# Altium project control_block.PrjPcb
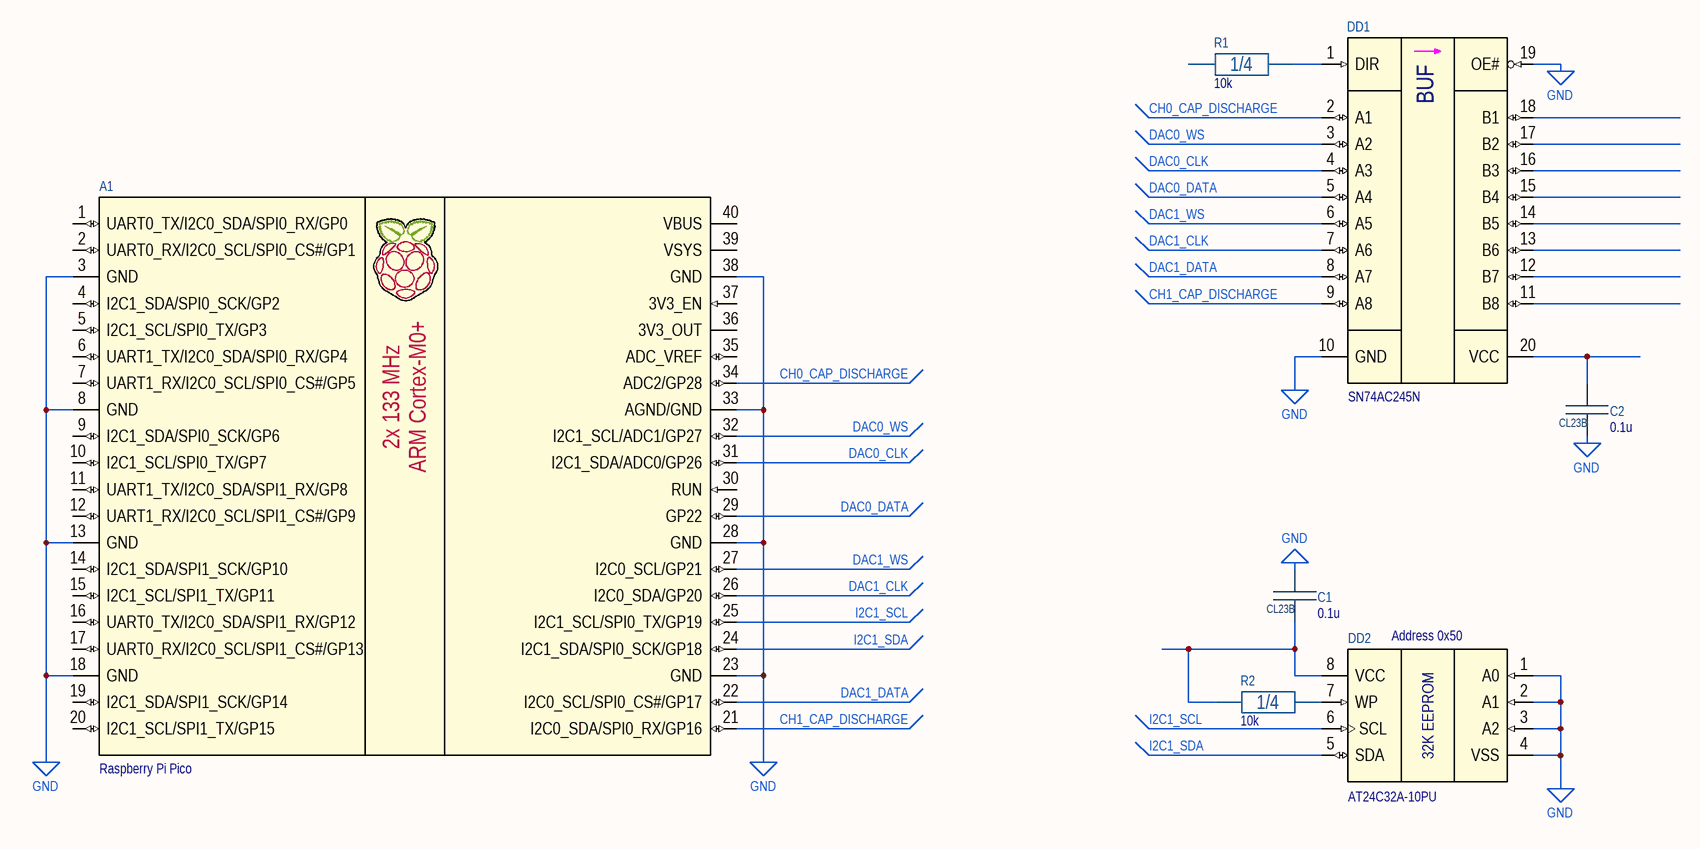
[diagram p0: p1_control_block.SchDoc]
4 sheets, 147 parts. Net scope: global (net labels, ports and power ports of the same name join across sheets).
Sheets:
  p1_control_block.SchDoc
  p2_eth_rs232.SchDoc
  p3_keypad_encoder_led.SchDoc
  p4_power_measure_ch1.SchDoc

## Sheet p1_control_block.SchDoc
size A2; Organization: Protel International P/L; Address1: L3, 12a Rodborough Rd; Address2: Frenchs Forest; Address3: NSW; Address4: Australia 2086

### Parts
A1  Raspberry Pi Pico  [Raspberry_Pi_Pico]
C1  0.1u  [CL23B_7.2x2.5]
C2  0.1u  [CL23B_7.2x2.5]
DD1  SN74AC245N  [DIP-20P-M01]
DD2  AT24C32A-10PU  [DIP-8P-M01_with_SO8]
R1  10k  Package: 1/4  [CFR-25]
R2  10k  Package: 1/4  [CFR-25]

### Nets
GND: A1.3(GND) A1.8(GND) A1.13(GND) A1.18(GND) A1.23(GND) A1.28(GND) A1.33(AGND/GND) A1.38(GND) C1.1 C2.2 DD1.10(GND) DD1.19(OE#) DD2.1(A0) DD2.2(A1) DD2.3(A2) DD2.4(VSS)
CH0_CAP_DISCHARGE: A1.34(ADC2/GP28) DD1.2(A1)
CH1_CAP_DISCHARGE: A1.21(I2C0_SDA/SPI0_RX/GP16) DD1.9(A8)
DAC0_CLK: A1.31(I2C1_SDA/ADC0/GP26) DD1.4(A3)
DAC0_DATA: A1.29(GP22) DD1.5(A4)
DAC0_WS: A1.32(I2C1_SCL/ADC1/GP27) DD1.3(A2)
DAC1_CLK: A1.26(I2C0_SDA/GP20) DD1.7(A6)
DAC1_DATA: A1.22(I2C0_SCL/SPI0_CS#/GP17) DD1.8(A7)
DAC1_WS: A1.27(I2C0_SCL/GP21) DD1.6(A5)
I2C1_SCL: A1.25(I2C1_SCL/SPI0_TX/GP19) DD2.6(SCL)
I2C1_SDA: A1.24(I2C1_SDA/SPI0_SCK/GP18) DD2.5(SDA)
NetC1_2: C1.2 DD2.8(VCC) R2.1
NetC2_1: C2.1 DD1.20(VCC)
NetDD1_1: DD1.1(DIR) R1.2
NetDD2_7: DD2.7(WP) R2.2

Not connected (* = marked no-connect by the designer): A1 1(UART0_TX/I2C0_SDA/SPI0_RX/GP0) 2(UART0_RX/I2C0_SCL/SPI0_CS#/GP1) 4(I2C1_SDA/SPI0_SCK/GP2) 5(I2C1_SCL/SPI0_TX/GP3) 6(UART1_TX/I2C0_SDA/SPI0_RX/GP4) 7(UART1_RX/I2C0_SCL/SPI0_CS#/GP5) 9(I2C1_SDA/SPI0_SCK/GP6) 10(I2C1_SCL/SPI0_TX/GP7) 11(UART1_TX/I2C0_SDA/SPI1_RX/GP8) 12(UART1_RX/I2C0_SCL/SPI1_CS#/GP9) 14(I2C1_SDA/SPI1_SCK/GP10) 15(I2C1_SCL/SPI1_TX/GP11) 16(UART0_TX/I2C0_SDA/SPI1_RX/GP12) 17(UART0_RX/I2C0_SCL/SPI1_CS#/GP13) 19(I2C1_SDA/SPI1_SCK/GP14) 20(I2C1_SCL/SPI1_TX/GP15) 30(RUN) 35(ADC_VREF) 36(3V3_OUT) 37(3V3_EN) 39(VSYS) 40(VBUS); DD1 11(B8) 12(B7) 13(B6) 14(B5) 15(B4) 16(B3) 17(B2) 18(B1); R1 1

### Notes on the sheet
- (near DD2) Address 0x50
- Title
- Size:
- Date:
- File:
- A2
- Number:
- Time:
- Revision:
- Sheet
- of
- (in symbol AT24C32A-10PU) 32K EEPROM
- (in symbol Raspberry Pi Pico) 2x 133 MHz; ARM Cortex-M0+
- (in symbol SN74AC245N) BUF

### Library data of the parts
A1 = Raspberry Pi Pico: Board Raspberry Pi Pico; Part Number: Raspberry Pi Pico; Manufacturer: Raspberry Pi
C1 C2 = CL23B: Box-type metallized polyester film capacitor; Tolerance: ± * %; Voltage: 63V; Value: 0.1u; Dielectric: Polyester; Value on schem: 0.1u; Part Number: *; Manufacturer: *; Package: CL23B
DD1 = SN74AC245N: 8-bit Bus Transceiver with 3-state outputs; Manufacturer: Texas Instruments; Part Number: SN74AC245N; Package: DIP-20
DD2 = AT24C32A-10PU: 32K I2C Serial EEPROM; Manufacturer: Microchip Technology; Package: DIP-8; Part Number: AT24C32A-10PU
R1 R2 = CF25: Resistor 1/4W; Part Number: MFR-25FTF52-10K; Manufacturer: Yageo; Tolerance: ± 1 %; Voltage: 250V; Temperature Coefficient: ±100 ppm/°C; Value: 10k; Value on schem: 10k

## Sheet p2_eth_rs232.SchDoc
size A1; Organization: Protel International P/L; Address1: L3, 12a Rodborough Rd; Address2: Frenchs Forest; Address3: NSW; Address4: Australia 2086
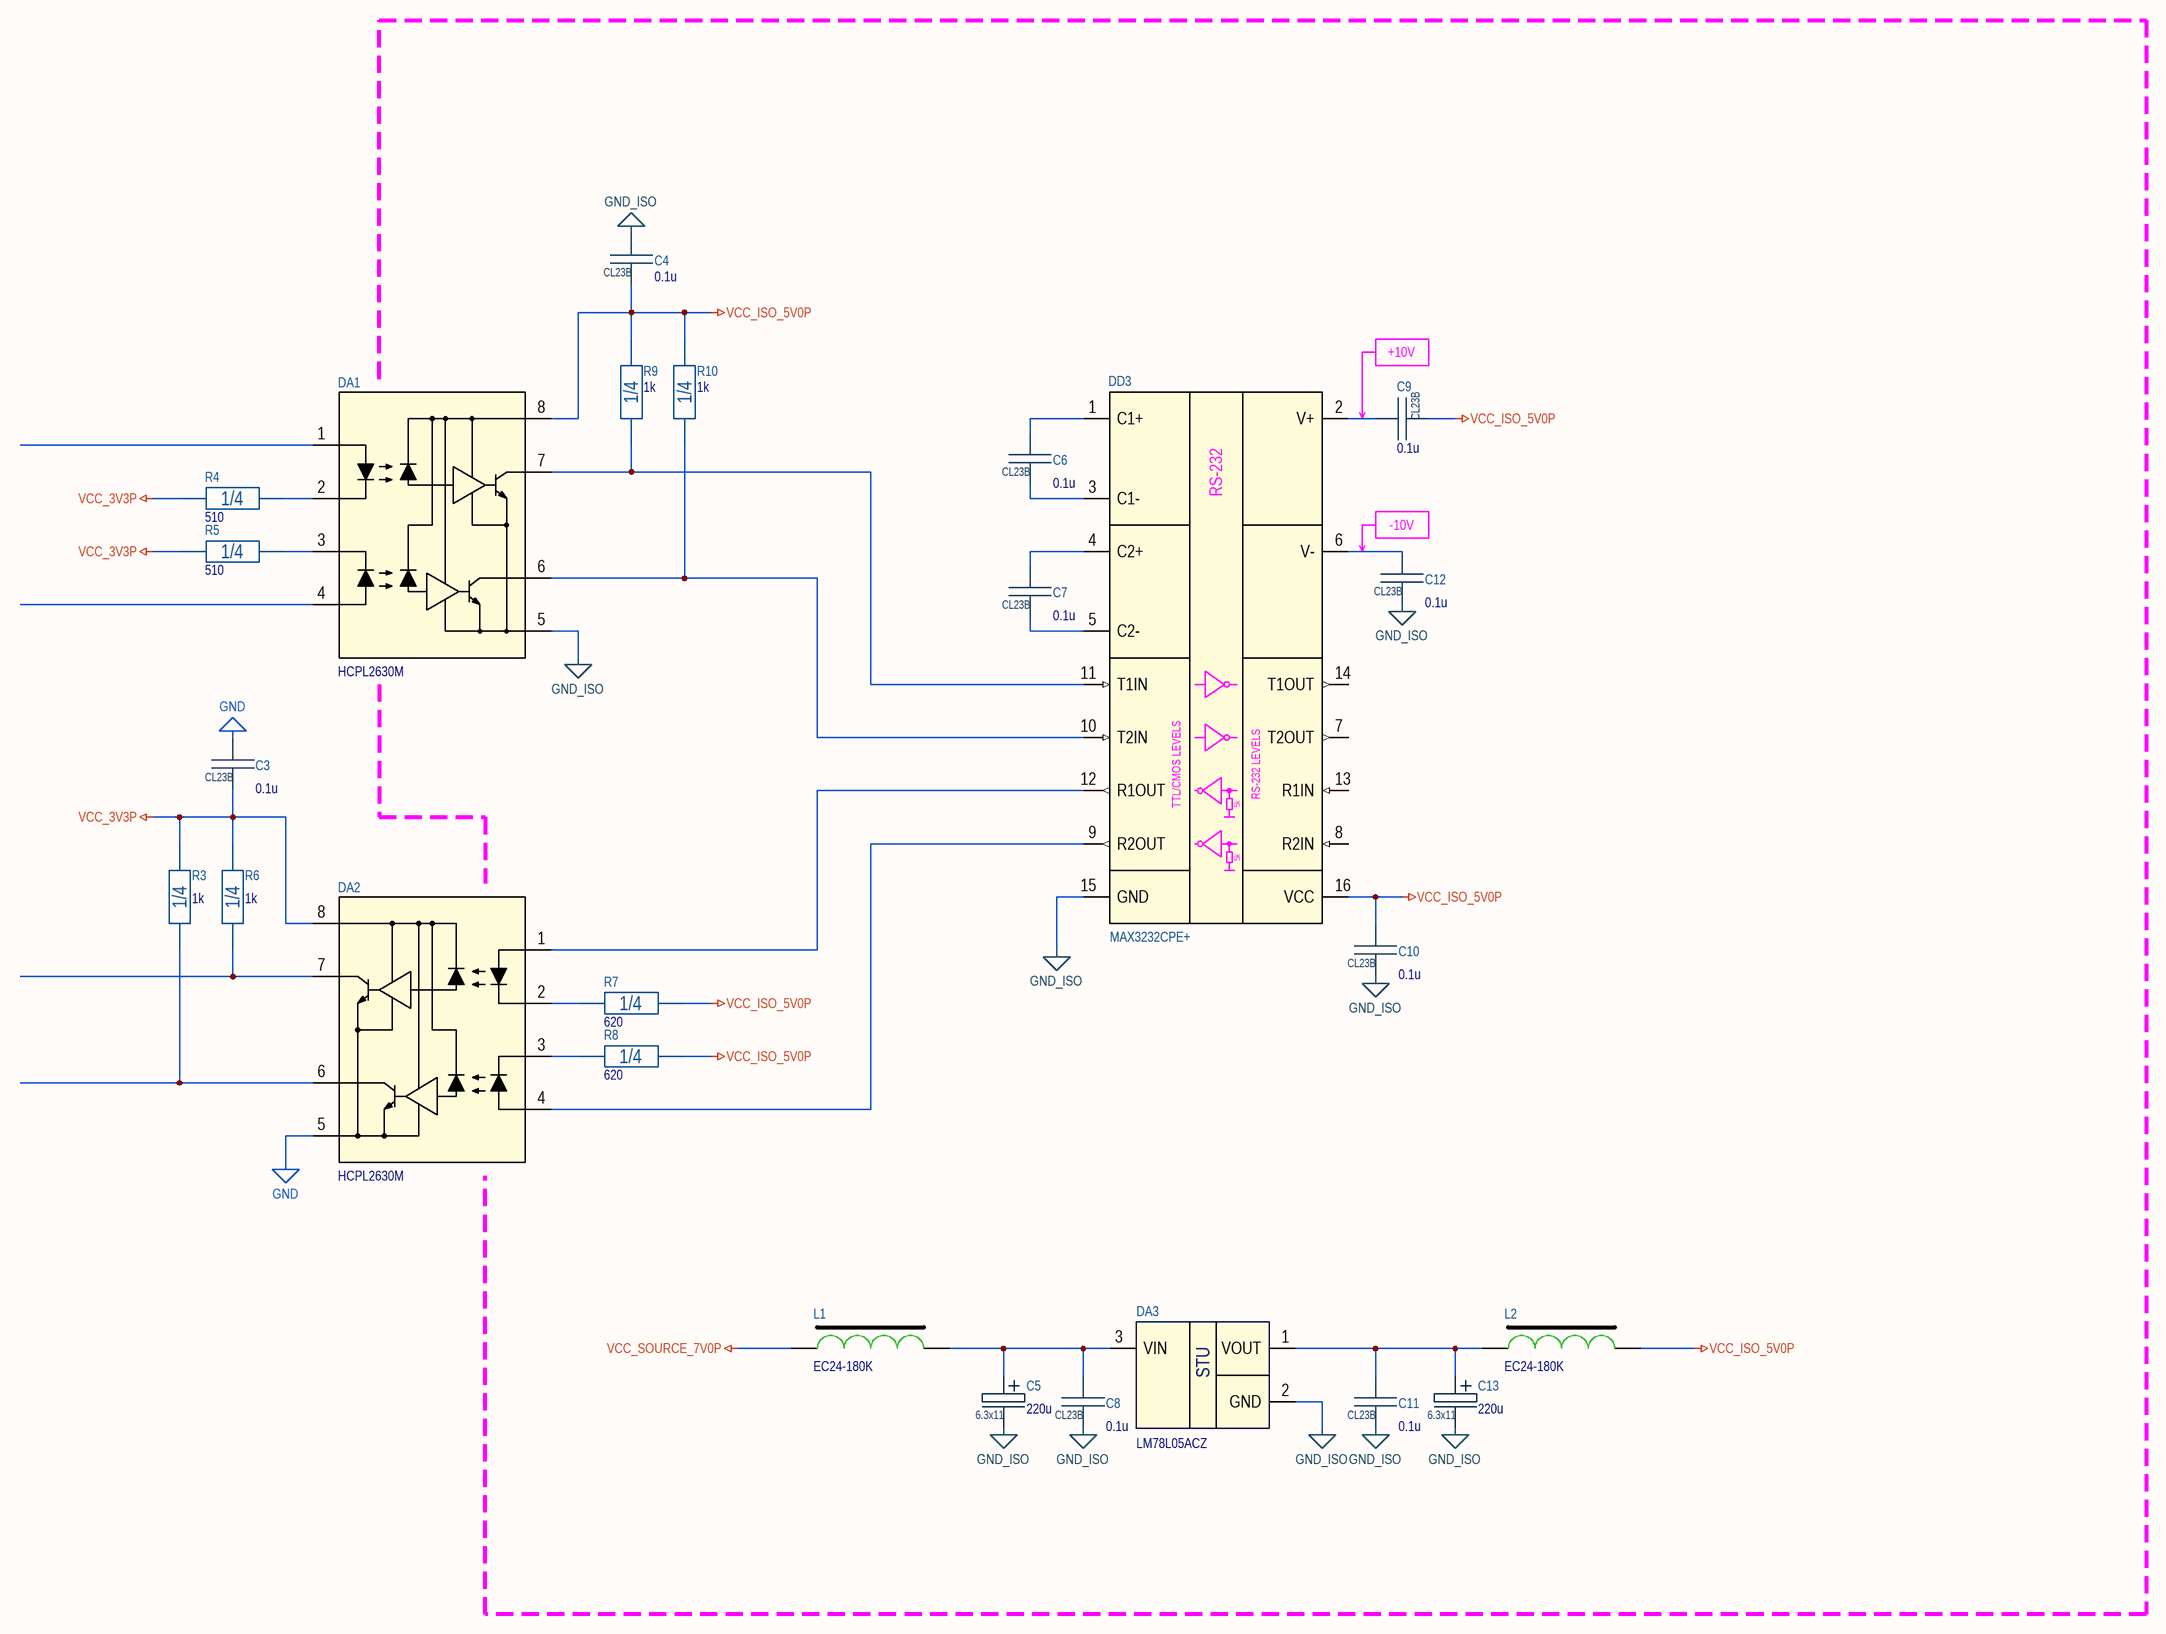
[diagram p1: p2_eth_rs232.SchDoc]

### Parts
C3  0.1u  [CL23B_7.2x2.5]
C4  0.1u  [CL23B_7.2x2.5]
C5  220u  Package: 6.3x11  [ECAP6.3X11X2.5_BRW]
C6  0.1u  [CL23B_7.2x2.5]
C7  0.1u  [CL23B_7.2x2.5]
C8  0.1u  [CL23B_7.2x2.5]
C9  0.1u  [CL23B_7.2x2.5]
C10  0.1u  [CL23B_7.2x2.5]
C11  0.1u  [CL23B_7.2x2.5]
C12  0.1u  [CL23B_7.2x2.5]
C13  220u  Package: 6.3x11  [ECAP6.3X11X2.5_BRW]
DA1  HCPL2630M  [DIP-8P-M01]
DA2  HCPL2630M  [DIP-8P-M01]
DA3  LM78L05ACZ  [TO-92 (VERTICAL,LINE)]
DD3  MAX3232CPE+  [DIP-16P-M03]
L1  EC24-180K  [EC24_GREEN]
L2  EC24-180K  [EC24_GREEN]
R3  1k  Package: 1/4  [CFR-25]
R4  510  Package: 1/4  [CFR-25]
R5  510  Package: 1/4  [CFR-25]
R6  1k  Package: 1/4  [CFR-25]
R7  620  Package: 1/4  [CFR-25]
R8  620  Package: 1/4  [CFR-25]
R9  1k  Package: 1/4  [CFR-25]
R10  1k  Package: 1/4  [CFR-25]

### Nets
GND: C3.1 DA2.5(GND)
GND_ISO: C4.1 C5.2 C8.2 C10.2 C11.2 C12.2 C13.2 DA1.5(GND) DA3.2(GND) DD3.15(GND)
VCC_3V3P: C3.2 DA2.8(VCC) R3.1 R4.1 R5.1 R6.1
VCC_ISO_5V0P: C4.2 C9.2 C10.1 DA1.8(VCC) DD3.16(VCC) L2.2 R7.1 R8.1 R9.1 R10.1
VCC_SOURCE_7V0P: L1.1
NetC5_1: C5.1 C8.1 DA3.3(VIN) L1.2
NetC6_1: C6.1 DD3.1(C1+)
NetC6_2: C6.2 DD3.3(C1-)
NetC7_1: C7.1 DD3.4(C2+)
NetC7_2: C7.2 DD3.5(C2-)
NetC9_1: C9.1 DD3.2(V+)
NetC11_1: C11.1 C13.1 DA3.1(VOUT) L2.1
NetC12_1: C12.1 DD3.6(V-)
NetDA1_2: DA1.2(CATHODE1) R4.2
NetDA1_3: DA1.3(CATHODE2) R5.2
NetDA1_6: DA1.6(V02) DD3.10(T2IN) R10.2
NetDA1_7: DA1.7(V01) DD3.11(T1IN) R9.2
NetDA2_1: DA2.1(ANODE1) DD3.12(R1OUT)
NetDA2_2: DA2.2(CATHODE1) R7.2
NetDA2_3: DA2.3(CATHODE2) R8.2
NetDA2_4: DA2.4(ANODE2) DD3.9(R2OUT)
NetDA2_6: DA2.6(V02) R3.2
NetDA2_7: DA2.7(V01) R6.2

Not connected (* = marked no-connect by the designer): DA1 1(ANODE1) 4(ANODE2); DD3 7(T2OUT) 8(R2IN) 13(R1IN) 14(T1OUT)

### Notes on the sheet
- +10V
- -10V
- Title
- Size:
- Date:
- File:
- A1
- Number:
- Time:
- Revision:
- Sheet
- of
- (in symbol LM78L05ACZ) STU
- (in symbol MAX3232CPE+) RS-232; TTL/CMOS LEVELS; RS-232 LEVELS; 5k

### Library data of the parts
C3 C4 C6-C12 = CL23B: as C1 on sheet p1_control_block; Value: 0.1u; Dielectric: Polyester; Value on schem: 0.1u; Part Number: *; Manufacturer: *; Package: CL23B
C5 C13 = C_ECAP: Aluminium capacitor; Part Number: EKZH160ELL221MF11D; Manufacturer: Nichicon; Tolerance: ± 20 %; Voltage: 16V; Value: 220u; Value on schem: 220u
DA1 DA2 = HCPL2630M: Dual-Channel High-Speed 10 MBit/s Logic Gate Optocouplers; Manufacturer: ON Semiconductor; Package: DIP-8; Part Number: HCPL2630M
DA3 = LM78L05ACZ: 100-mA Fixed Output Linear Regulator; Manufacturer: Texas Instruments; Part Number: LM78L05ACZ; Package: TO-92
DD3 = MAX3232CPE+: 3.0V to 5.5V, Low-Power, Up to 1Mbps, True RS-232 Transceivers; Manufacturer: Maxim Integrated; Part Number: MAX3232CPE+; Package: DIP-16
L1 L2 = EC24: Axial leaded coated inductors; Manufacturer: 3L Electronic; RDC: 1 Ohm; SRF Min: 15 MHz; Q: 40; Irms  Max: 315 mA; Inductance @ 100 kHz: 18 µH; Part Number: EC24-180K; Package: EC24
R3 R6 R9 R10 = CF25: Resistor 1/4W; Part Number: MFR-25FTF52-1K; Manufacturer: Yageo; Tolerance: ± 1 %; Voltage: 250V; Temperature Coefficient: ±100 ppm/°C; Value: 1k; Value on schem: 1k
R4 R5 = CF25: Resistor 1/4W; Part Number: MFR-25FTF52-510R; Manufacturer: Yageo; Tolerance: ± 1 %; Voltage: 250V; Temperature Coefficient: ±100 ppm/°C; Value: 510; Value on schem: 510
R7 R8 = CF25: Resistor 1/4W; Part Number: MFR-25FTF52-620R; Manufacturer: Yageo; Tolerance: ± 1 %; Voltage: 250V; Temperature Coefficient: ±100 ppm/°C; Value: 620; Value on schem: 620

## Sheet p3_keypad_encoder_led.SchDoc
size A2; Organization: Protel International P/L; Address1: L3, 12a Rodborough Rd; Address2: Frenchs Forest; Address3: NSW; Address4: Australia 2086
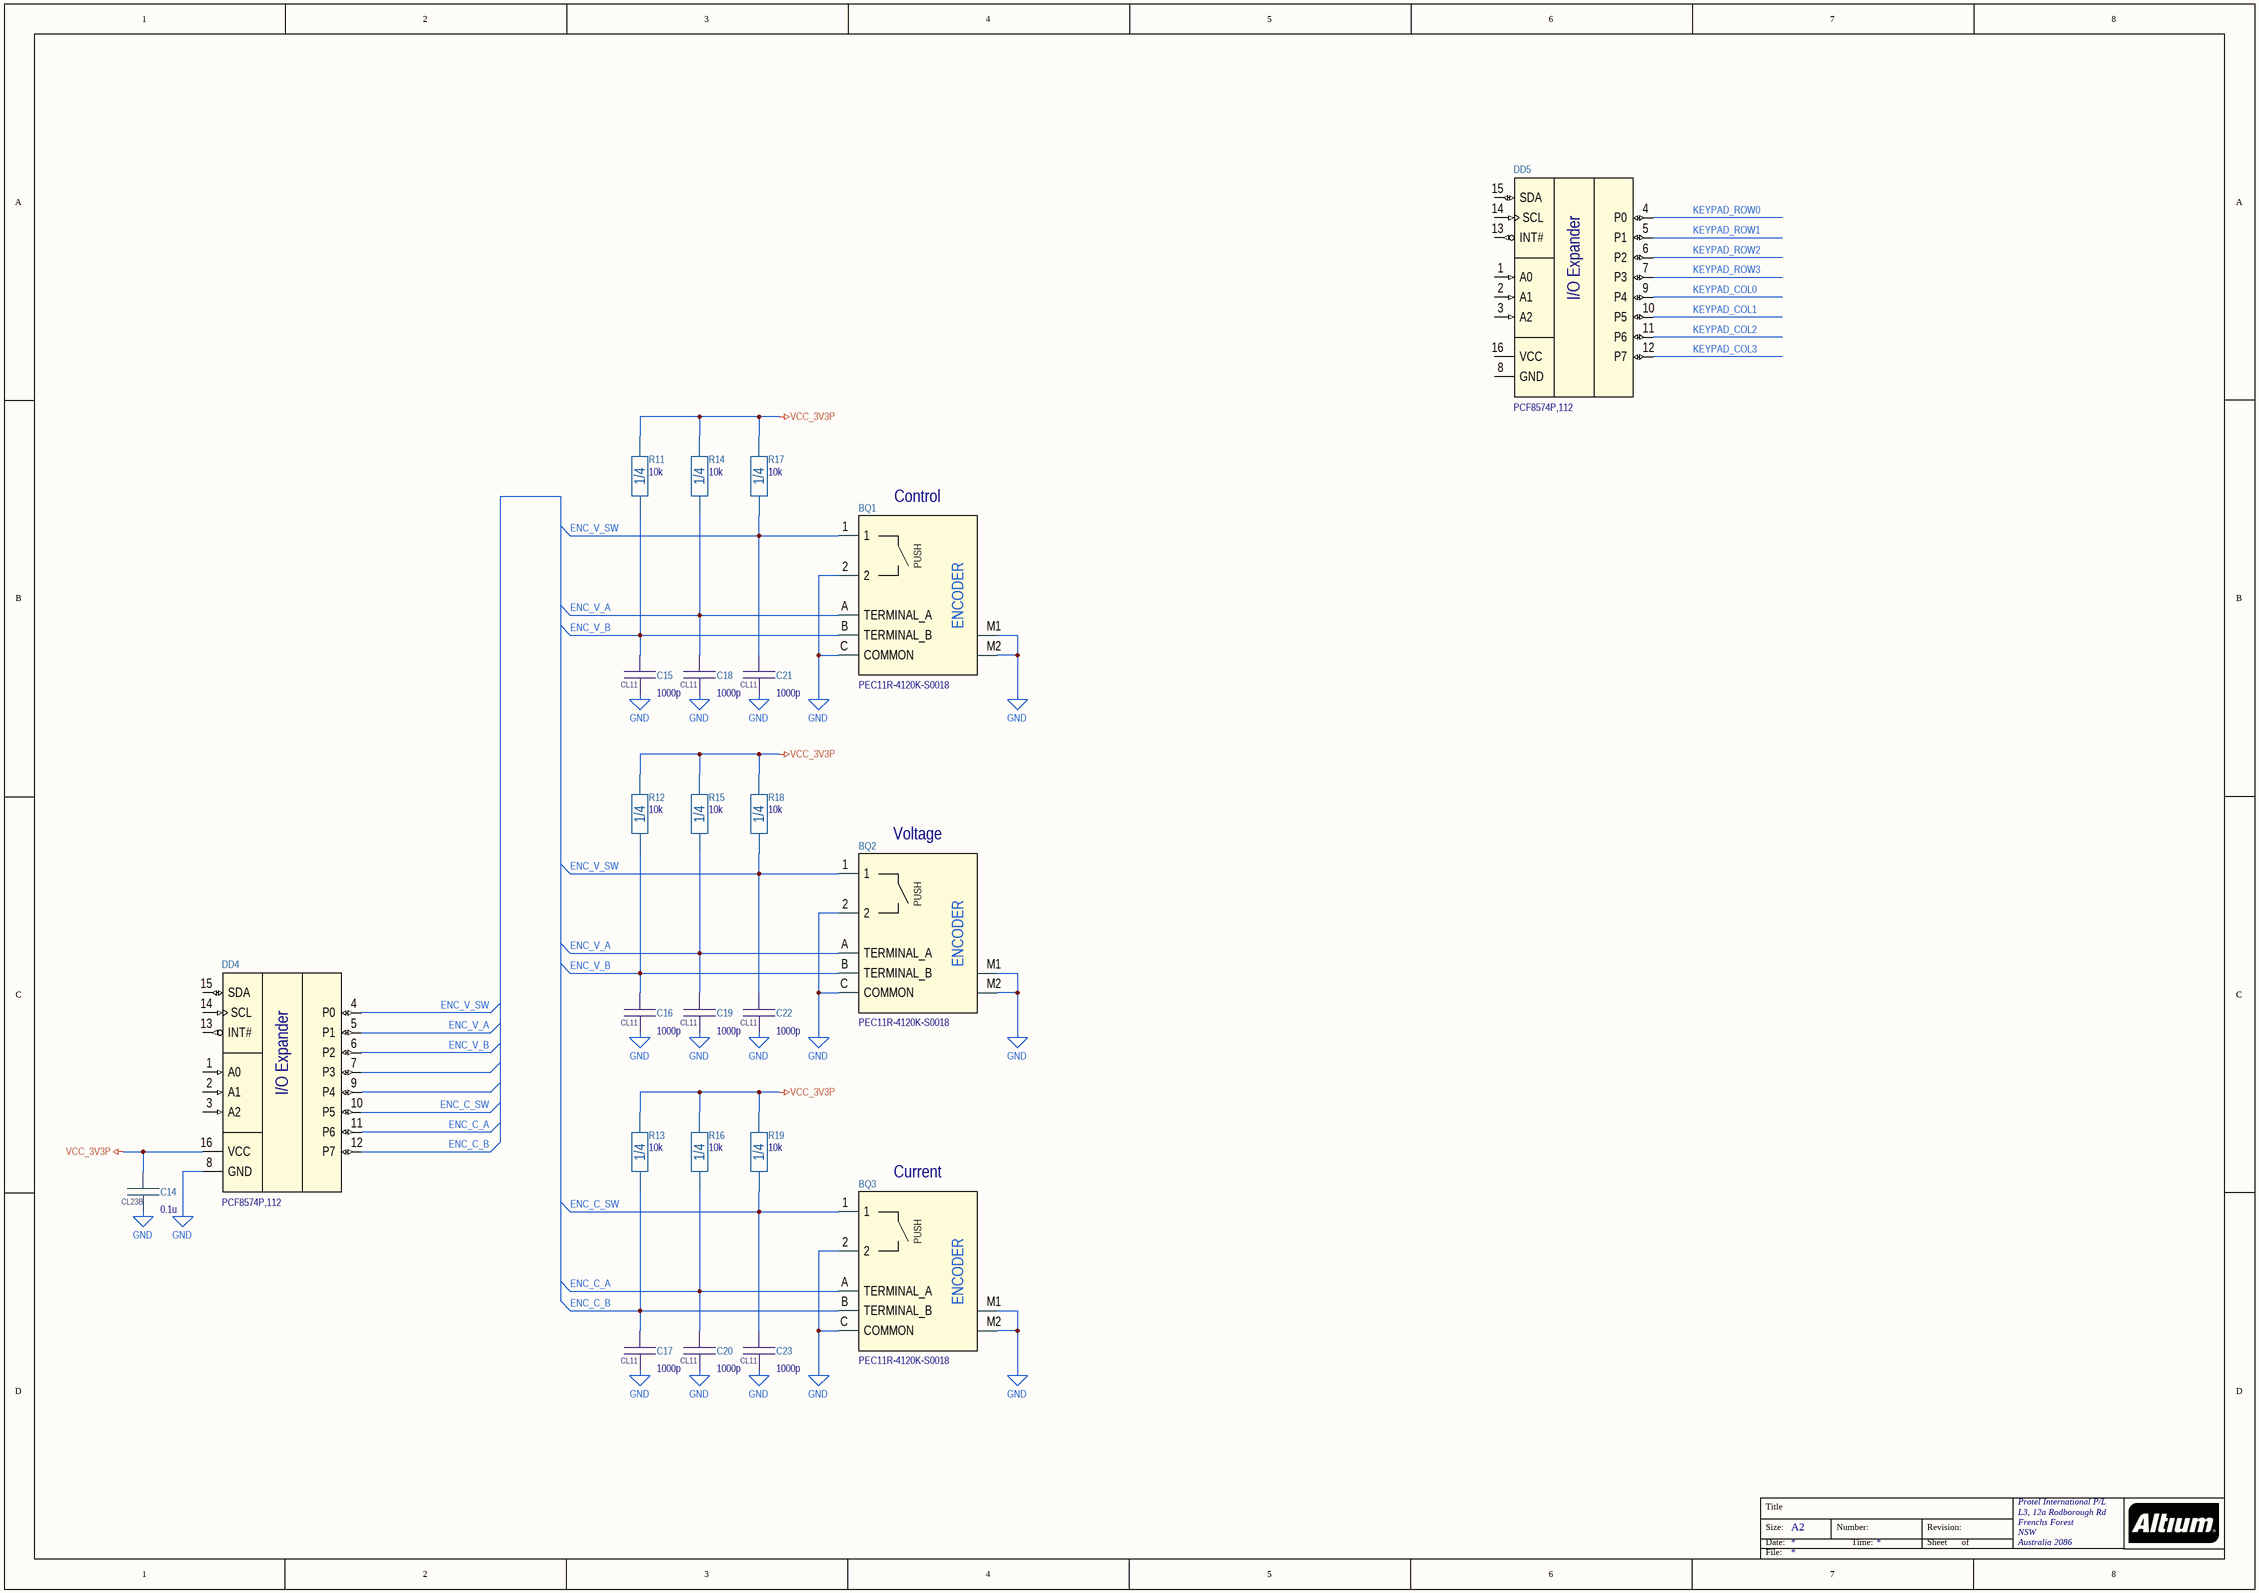
[diagram p2: p3_keypad_encoder_led.SchDoc]

### Parts
BQ1  PEC11R-4120K-S0018  [PEC11R-4120K-S0018]
BQ2  PEC11R-4120K-S0018  [PEC11R-4120K-S0018]
BQ3  PEC11R-4120K-S0018  [PEC11R-4120K-S0018]
C14  0.1u  [CL23B_7.2x2.5]
C15  1000p  [CL11_6x3.5_P3.5]
C16  1000p  [CL11_6x3.5_P3.5]
C17  1000p  [CL11_6x3.5_P3.5]
C18  1000p  [CL11_6x3.5_P3.5]
C19  1000p  [CL11_6x3.5_P3.5]
C20  1000p  [CL11_6x3.5_P3.5]
C21  1000p  [CL11_6x3.5_P3.5]
C22  1000p  [CL11_6x3.5_P3.5]
C23  1000p  [CL11_6x3.5_P3.5]
DD4  PCF8574P,112  [DIP-16P-M03]
DD5  PCF8574P,112  [DIP-16P-M03]
R11  10k  Package: 1/4  [CFR-25]
R12  10k  Package: 1/4  [CFR-25]
R13  10k  Package: 1/4  [CFR-25]
R14  10k  Package: 1/4  [CFR-25]
R15  10k  Package: 1/4  [CFR-25]
R16  10k  Package: 1/4  [CFR-25]
R17  10k  Package: 1/4  [CFR-25]
R18  10k  Package: 1/4  [CFR-25]
R19  10k  Package: 1/4  [CFR-25]

### Nets
GND: BQ1.2 BQ1.C(COMMON) BQ1.M1(MECHANICAL1) BQ1.M2(MECHANICAL2) BQ2.2 BQ2.C(COMMON) BQ2.M1(MECHANICAL1) BQ2.M2(MECHANICAL2) BQ3.2 BQ3.C(COMMON) BQ3.M1(MECHANICAL1) BQ3.M2(MECHANICAL2) C14.2 C15.1 C16.1 C17.1 C18.1 C19.1 C20.1 C21.1 C22.1 C23.1 DD4.8(GND)
VCC_3V3P: C14.1 DD4.16(VCC) R11.2 R12.2 R13.2 R14.2 R15.2 R16.2 R17.2 R18.2 R19.2
ENC_C_A: BQ3.A(TERMINAL_A) C20.2 DD4.11(P6) R16.1
ENC_C_B: BQ3.B(TERMINAL_B) C17.2 DD4.12(P7) R13.1
ENC_C_SW: BQ3.1 C23.2 DD4.10(P5) R19.1
ENC_V_A: BQ1.A(TERMINAL_A) BQ2.A(TERMINAL_A) C18.2 C19.2 DD4.5(P1) R14.1 R15.1
ENC_V_B: BQ1.B(TERMINAL_B) BQ2.B(TERMINAL_B) C15.2 C16.2 DD4.6(P2) R11.1 R12.1
ENC_V_SW: BQ1.1 BQ2.1 C21.2 C22.2 DD4.4(P0) R17.1 R18.1
KEYPAD_COL0: DD5.9(P4)
KEYPAD_COL1: DD5.10(P5)
KEYPAD_COL2: DD5.11(P6)
KEYPAD_COL3: DD5.12(P7)
KEYPAD_ROW0: DD5.4(P0)
KEYPAD_ROW1: DD5.5(P1)
KEYPAD_ROW2: DD5.6(P2)
KEYPAD_ROW3: DD5.7(P3)

Not connected (* = marked no-connect by the designer): DD4 1(A0) 2(A1) 3(A2) 7(P3) 9(P4) 13(INT#) 14(SCL) 15(SDA); DD5 1(A0) 2(A1) 3(A2) 8(GND) 13(INT#) 14(SCL) 15(SDA) 16(VCC)

### Notes on the sheet
- (near BQ1) Control
- (near BQ2) Voltage
- (near BQ3) Current
- Title
- Size:
- Date:
- File:
- A2
- Number:
- Time:
- Revision:
- Sheet
- of
- (in symbol PCF8574P,112) I/O Expander
- (in symbol PEC11R-4120K-S0018) PUSH; ENCODER

### Library data of the parts
BQ1-BQ3 = PEC11R-4120K-S0018: 12 mm Incremental Encoder; Manufacturer: Bourns Inc.; Part Number: PEC11R-4120K-S0018
C14 = CL23B: as C1 on sheet p1_control_block; Value: 0.1u; Dielectric: Polyester; Value on schem: 0.1u; Part Number: *; Manufacturer: *; Package: CL23B
C15-C23 = CL11: CL11 Type Polyester Film Metal Foil Capacitor-inductive; Tolerance: ± 5 %; Voltage: 100V; Value: 1000p; Dielectric: Polyester; Value on schem: 1000p; Part Number: *; Manufacturer: *; Package: CL11
DD4 DD5 = PCF8574P,112: Remote 8-bit I/O expander for I2C-bus; Manufacturer: NXP USA Inc.; Package: DIP-16; Part Number: PCF8574P,112
R11-R19 = CF25: as R1 on sheet p1_control_block; Value: 10k; Value on schem: 10k

## Sheet p4_power_measure_ch1.SchDoc
size A1; Organization: Protel International P/L; Address1: L3, 12a Rodborough Rd; Address2: Frenchs Forest; Address3: NSW; Address4: Australia 2086
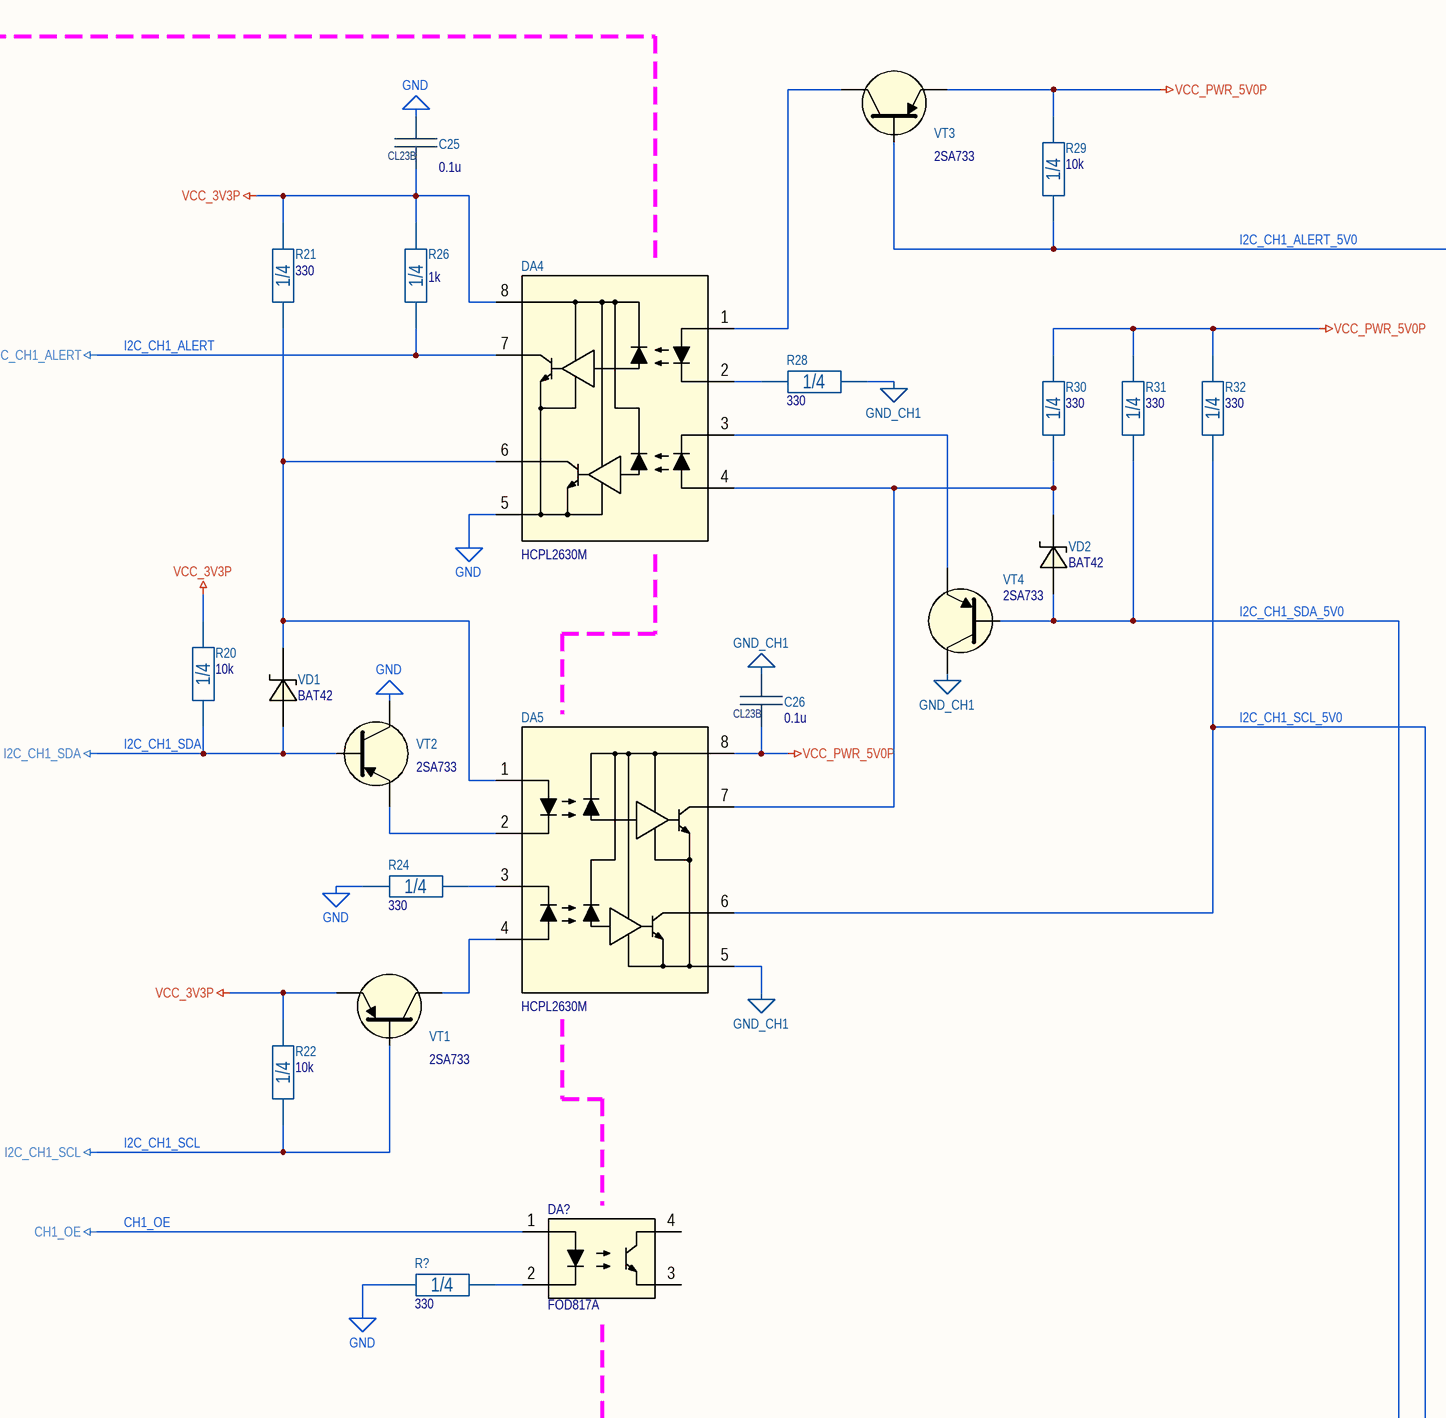
[diagram p3: p4_power_measure_ch1.SchDoc, top left]
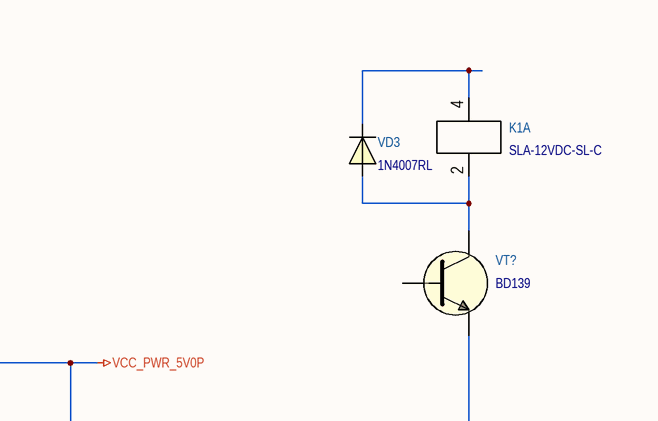
[diagram p4: p4_power_measure_ch1.SchDoc, top right]
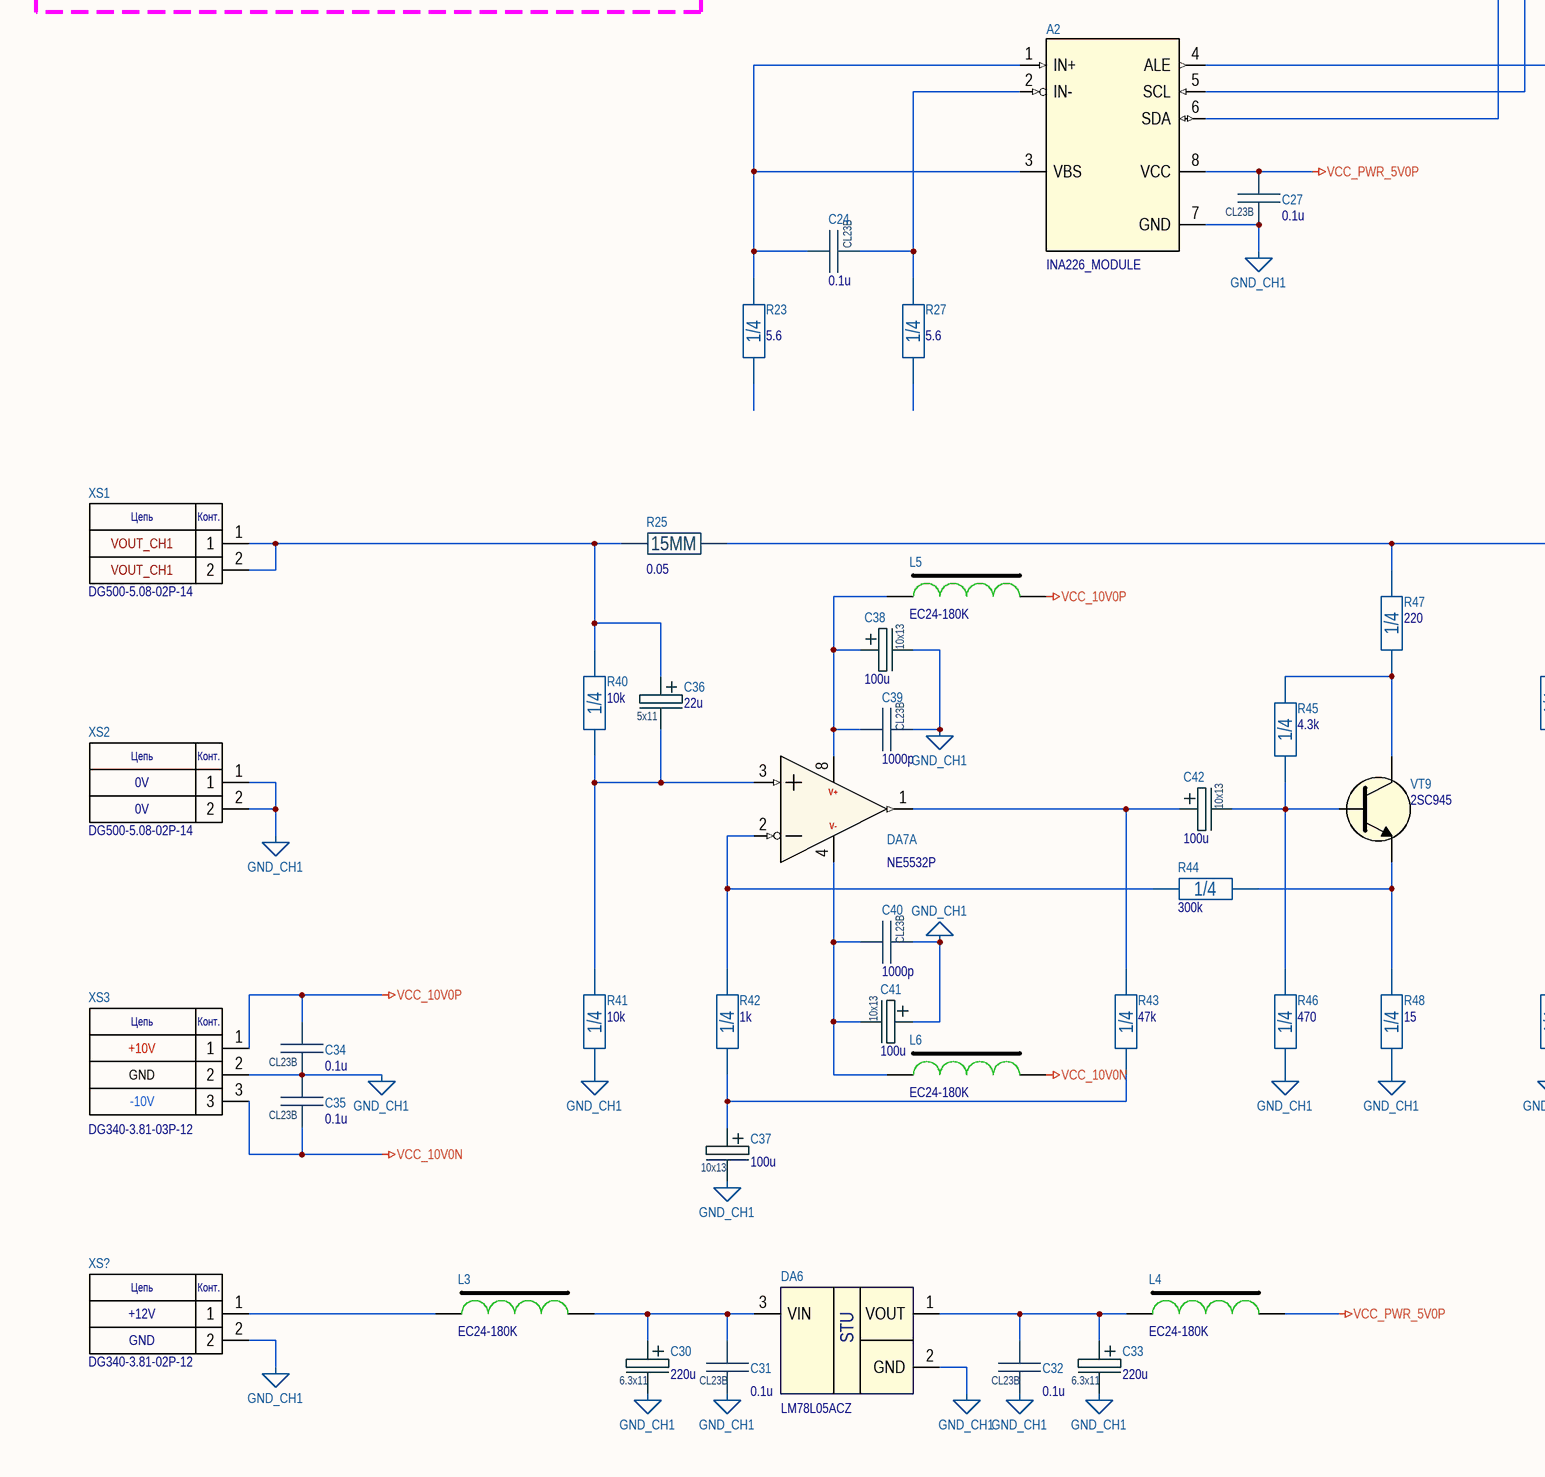
[diagram p5: p4_power_measure_ch1.SchDoc, bottom left]
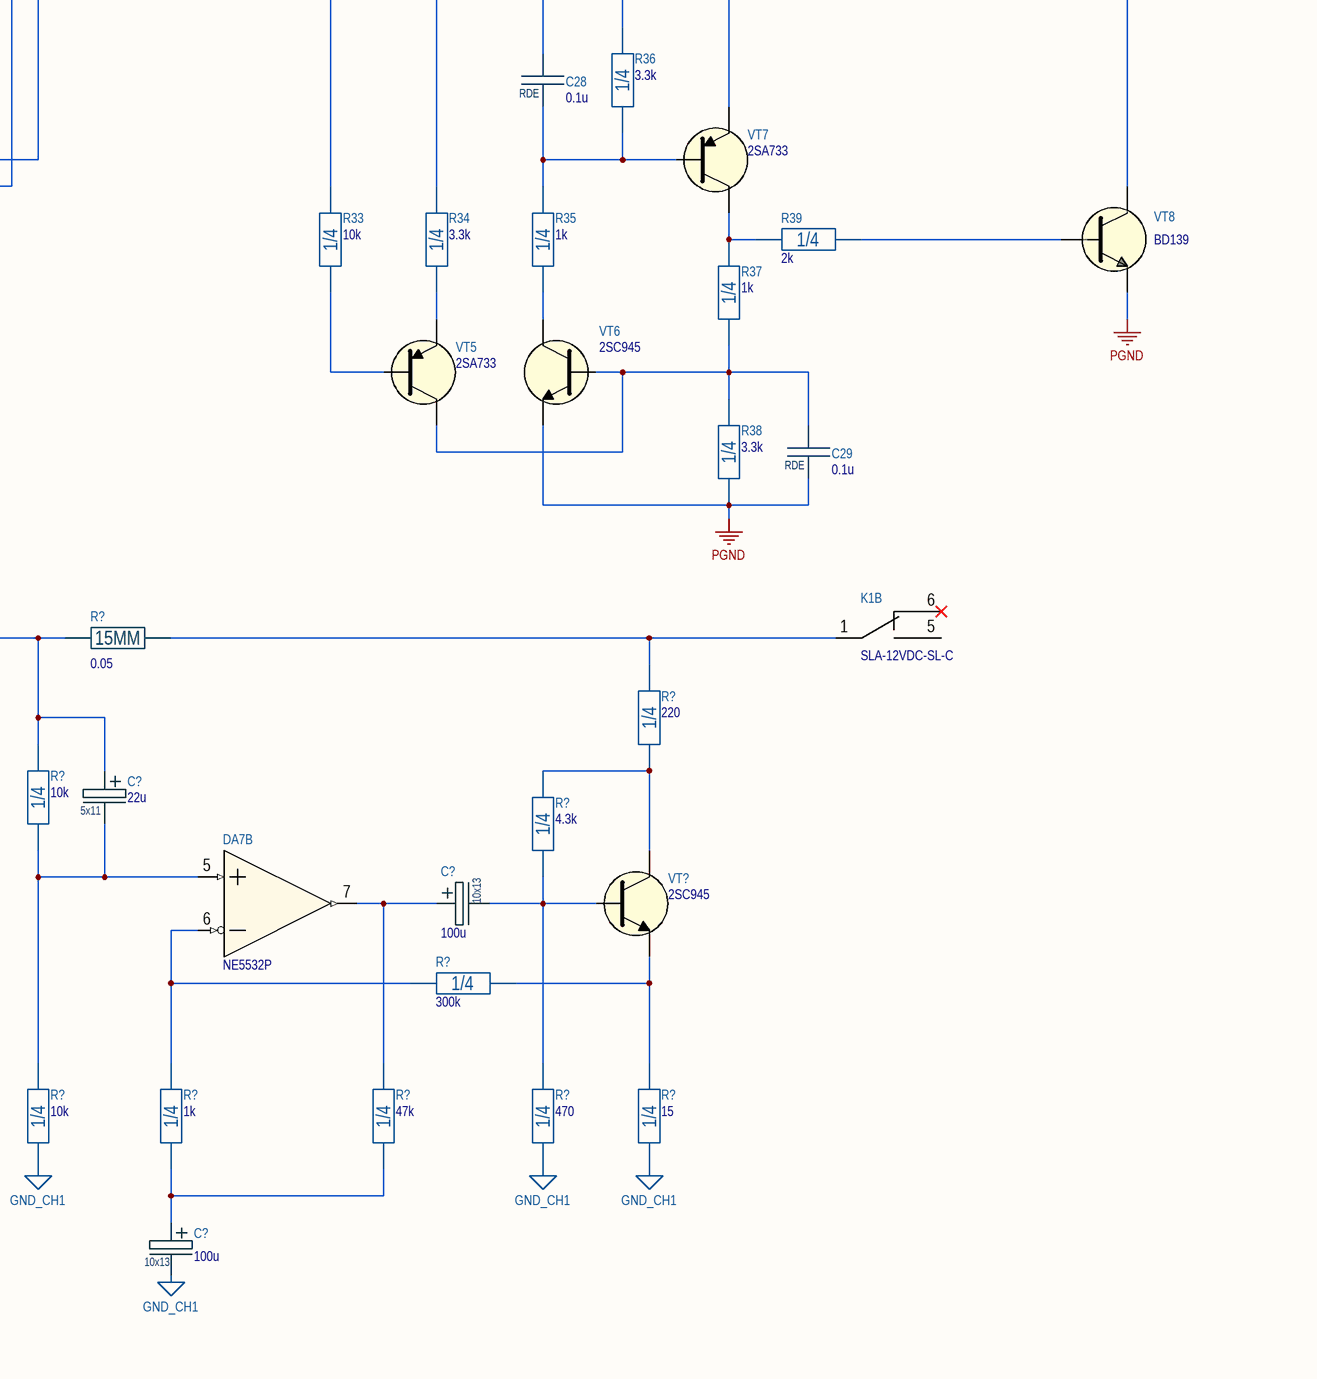
[diagram p6: p4_power_measure_ch1.SchDoc, bottom right]

### Parts
(Parts that share a designator on the sheet are numbered #1, #2 ... from top to bottom, then left to right.)
A2  INA226_MODULE  [INA226_MODULE_VERT]
C24  0.1u  [CL23B_7.2x2.5]
C25  0.1u  [CL23B_7.2x2.5]
C26  0.1u  [CL23B_7.2x2.5]
C27  0.1u  [CL23B_7.2x2.5]
C28  0.1u  Package: RDE  [RDE_1P1]
C29  0.1u  Package: RDE  [RDE_1P1]
C30  220u  Package: 6.3x11  [ECAP6.3X11X2.5_BRW]
C31  0.1u  [CL23B_7.2x2.5]
C32  0.1u  [CL23B_7.2x2.5]
C33  220u  Package: 6.3x11  [ECAP6.3X11X2.5_BRW]
C34  0.1u  [CL23B_7.2x2.5]
C35  0.1u  [CL23B_7.2x2.5]
C36  22u  Package: 5x11  [ECAP5X11X2.0_BRW]
C37  100u  Package: 10x13  [ECAP10X13X5_BRW]
C38  100u  Package: 10x13  [ECAP10X13X5_BRW]
C39  1000p  [CL23B_7.2x2.5]
C40  1000p  [CL23B_7.2x2.5]
C41  100u  Package: 10x13  [ECAP10X13X5_BRW]
C42  100u  Package: 10x13  [ECAP10X13X5_BRW]
C?#1  22u  Package: 5x11  [ECAP5X11X2.0_BRW]
C?#2  100u  Package: 10x13  [ECAP10X13X5_BRW]
C?#3  100u  Package: 10x13  [ECAP10X13X5_BRW]
DA4  HCPL2630M  [DIP-8P-M01]
DA5  HCPL2630M  [DIP-8P-M01]
DA6  LM78L05ACZ  [TO-92 (VERTICAL,LINE)]
DA7  NE5532P  [DIP-8P-M01]  (parts A,B of 2)
DA?  FOD817A  [DIP-4P]
K1  SLA-12VDC-SL-C  [RELAY_32x27.5MM]  (parts A,B of 2)
L3  EC24-180K  [EC24_GREEN]
L4  EC24-180K  [EC24_GREEN]
L5  EC24-180K  [EC24_GREEN]
L6  EC24-180K  [EC24_GREEN]
R20  10k  Package: 1/4  [CFR-25]
R21  330  Package: 1/4  [CFR-25]
R22  10k  Package: 1/4  [CFR-25]
R23  5.6  Package: 1/4  [CFR-25(VERTICAL)]
R24  330  Package: 1/4  [CFR-25]
R25  0.05  Package: 15MM  [CURRENT_SENSE_15x18mm]
R26  1k  Package: 1/4  [CFR-25]
R27  5.6  Package: 1/4  [CFR-25(VERTICAL)]
R28  330  Package: 1/4  [CFR-25]
R29  10k  Package: 1/4  [CFR-25]
R30  330  Package: 1/4  [CFR-25]
R31  330  Package: 1/4  [CFR-25]
R32  330  Package: 1/4  [CFR-25]
R33  10k  Package: 1/4  [CFR-25]
R34  3.3k  Package: 1/4  [CFR-25]
R35  1k  Package: 1/4  [CFR-25]
R36  3.3k  Package: 1/4  [CFR-25]
R37  1k  Package: 1/4  [CFR-25]
R38  3.3k  Package: 1/4  [CFR-25]
R39  2k  Package: 1/4  [CFR-25]
R40  10k  Package: 1/4  [CFR-25]
R41  10k  Package: 1/4  [CFR-25]
R42  1k  Package: 1/4  [CFR-25]
R43  47k  Package: 1/4  [CFR-25]
R44  300k  Package: 1/4  [CFR-25]
R45  4.3k  Package: 1/4  [CFR-25]
R46  470  Package: 1/4  [CFR-25]
R47  220  Package: 1/4  [CFR-25]
R48  15  Package: 1/4  [CFR-25]
R?#1  330  Package: 1/4  [CFR-25]
R?#2  0.05  Package: 15MM  [CURRENT_SENSE_15x18mm]
R?#3  220  Package: 1/4  [CFR-25]
R?#4  10k  Package: 1/4  [CFR-25]
R?#5  4.3k  Package: 1/4  [CFR-25]
R?#6  300k  Package: 1/4  [CFR-25]
R?#7  10k  Package: 1/4  [CFR-25]
R?#8  1k  Package: 1/4  [CFR-25]
R?#9  47k  Package: 1/4  [CFR-25]
R?#10  470  Package: 1/4  [CFR-25]
R?#11  15  Package: 1/4  [CFR-25]
VD1  BAT42  [DO-35 GLASS BLUE]
VD2  BAT42  [DO-35 GLASS BLUE]
VD3  1N4007RL  [DO-41]
VT1  2SA733  [TO-92 (VERTICAL,LINE)]
VT2  2SA733  [TO-92 (VERTICAL,LINE)]
VT3  2SA733  [TO-92 (VERTICAL,LINE)]
VT4  2SA733  [TO-92 (VERTICAL,LINE)]
VT5  2SA733  [TO-92 (VERTICAL,LINE)]
VT6  2SC945  [TO-92 (VERTICAL,LINE)]
VT7  2SA733  [TO-92 (VERTICAL,LINE)]
VT8  BD139  [TO-126 (VERTICAL)]
VT9  2SC945  [TO-92 (VERTICAL,LINE)]
VT?#1  BD139  [TO-126 (VERTICAL)]
VT?#2  2SC945  [TO-92 (VERTICAL,LINE)]
XS1  DG500-5.08-02P-14  [DG500-5.08-02P]
XS2  DG500-5.08-02P-14  [DG500-5.08-02P]
XS3  DG340-3.81-03P-12  [DG340-3.81-03P]
XS?  DG340-3.81-02P-12  [DG340-3.81-02P]

### Nets
CH1_OE: DA?.1(ANODE)
GND: C25.1 DA4.5(GND) R24.1 R?#1.1 VT2.2(C)
GND_CH1: A2.7(GND) C26.1 C27.2 C30.2 C31.2 C32.2 C33.2 C34.2 C35.1 C37.2 C38.2 C39.2 C40.2 C41.1 C?#3.2 DA5.5(GND) DA6.2(GND) R28.2 R41.1 R46.1 R48.1 R?#7.1 R?#10.1 R?#11.1 VT4.2(C) XS2.1 XS2.2 XS3.2 XS?.2
I2C_CH1_ALERT: DA4.7(V01) R26.2
I2C_CH1_SCL: R22.1 VT1.1(B)
I2C_CH1_SDA: R20.1 VD1.2(ANODE) VT2.1(B)
PGND: C29.2 R38.1 VT6.3(E) VT8.3(E)
VCC_3V3P: C25.2 DA4.8(VCC) R20.2 R21.1 R22.2 R26.1 VT1.3(E)
VCC_10V0N: C35.2 L6.2 XS3.3
VCC_10V0P: C34.1 L5.2 XS3.1
VCC_PWR_5V0P: A2.8(VCC) C26.2 C27.1 C28.1 DA5.8(VCC) L4.2 R29.2 R30.1 R31.1 R32.1 R33.2 R34.2 R36.2 VT3.3(E) VT7.3(E)
I2C_CH1_ALERT_5V0: A2.4(ALE) R29.1 VT3.1(B)
I2C_CH1_SCL_5V0: A2.5(SCL) DA5.6(V02) R32.2
I2C_CH1_SDA_5V0: A2.6(SDA) R31.2 VD2.2(ANODE) VT4.1(B)
NetA2_1: A2.1(IN+) A2.3(VBS) C24.1 R23.1
NetA2_2: A2.2(IN-) C24.2 R27.1
NetC28_2: C28.2 R35.2 R36.1 VT7.1(B)
NetC29_1: C29.1 R37.1 R38.2 VT5.2(C) VT6.1(B)
NetC30_1: C30.1 C31.1 DA6.3(VIN) L3.2
NetC32_1: C32.1 C33.1 DA6.1(VOUT) L4.1
NetC36_1: C36.1 R25.1 R40.2 XS1.1 XS1.2
NetC36_2: C36.2 DA7.3(1IN+) R40.1 R41.2
NetC37_1: C37.1 R42.1 R43.1
NetC38_1: C38.1 C39.1 DA7.8(VCC) L5.1
NetC40_1: C40.1 C41.2 DA7.4(GND) L6.1
NetC42_1: C42.1 DA7.1(1OUT) R43.2
NetC42_2: C42.2 R45.1 R46.2 VT9.1(B)
NetC?#1_1: C?#1.1 R25.2 R47.2 R?#2.1 R?#4.2
NetC?#1_2: C?#1.2 DA7.5(2IN+) R?#4.1 R?#7.2
NetC?#2_1: C?#2.1 DA7.7(2OUT) R?#9.2
NetC?#2_2: C?#2.2 R?#5.1 R?#10.2 VT?#2.1(B)
NetC?#3_1: C?#3.1 R?#8.1 R?#9.1
NetDA4_1: DA4.1(ANODE1) VT3.2(C)
NetDA4_2: DA4.2(CATHODE1) R28.1
NetDA4_3: DA4.3(CATHODE2) VT4.3(E)
NetDA4_4: DA4.4(ANODE2) DA5.7(V01) R30.2 VD2.1(CATHODE)
NetDA4_6: DA4.6(V02) DA5.1(ANODE1) R21.2 VD1.1(CATHODE)
NetDA5_2: DA5.2(CATHODE1) VT2.3(E)
NetDA5_3: DA5.3(CATHODE2) R24.2
NetDA5_4: DA5.4(ANODE2) VT1.2(C)
NetDA7_2: DA7.2(1IN-) R42.2 R44.2
NetDA7_6: DA7.6(2IN-) R?#6.2 R?#8.2
NetDA?_2: DA?.2(CATHODE) R?#1.2
NetK1_1: K1.1 R?#2.2 R?#3.2
NetK1_2: K1.2 VD3.2(A) VT?#1.2(C)
NetK1_4: K1.4 VD3.1(C)
NetL3_1: L3.1 XS?.1
NetR33_1: R33.1 VT5.1(B)
NetR34_1: R34.1 VT5.3(E)
NetR35_1: R35.1 VT6.2(C)
NetR37_2: R37.2 R39.1 VT7.2(C)
NetR39_2: R39.2 VT8.1(B)
NetR44_1: R44.1 R48.2 VT9.3(E)
NetR45_2: R45.2 R47.1 VT9.2(C)
NetR?#3_1: R?#3.1 R?#5.2 VT?#2.2(C)
NetR?#6_1: R?#6.1 R?#11.2 VT?#2.3(E)
NetVT8_2: VT8.2(C) VT?#1.3(E)

Not connected (* = marked no-connect by the designer): DA? 3(EMITTER) 4(COLLECTOR); K1 5 6*; R23 2; R27 2; VT?#1 1(B)

### Notes on the sheet
- (near XS1) VOUT_CH1
- 0V
- +10V
- GND
- -10V
- +12V
- Title
- Size:
- Date:
- File:
- A1
- Number:
- Time:
- Revision:
- Sheet
- of
- (in symbol DG340-3.81-02P-12) Цепь; Конт.
- (in symbol DG340-3.81-03P-12) Цепь; Конт.
- (in symbol DG500-5.08-02P-14) Цепь; Конт.
- (in symbol LM78L05ACZ) STU
- (in symbol NE5532P, part A) V+; V-

### Library data of the parts
A2 = INA226_MODULE: 20x20mm module with INA226; Part Number: INA226_MODULE
C24-C27 C31 C32 C34 C35 C39 C40 = CL23B: as C1 on sheet p1_control_block; Dielectric: Polyester; Part Number: *; Manufacturer: *; Package: CL23B
  C24-C27 C31 C32 C34 C35: Value: 0.1u; Value on schem: 0.1u
  C39 C40: Value: 1000p; Value on schem: 1000p
C28 C29 = RDE_CAP: MLCC radial lead type with epoxy coat (RDE Series); Part Number: RDER72A104K1P1H03B; Manufacturer: Murata; Tolerance: ± 10 %; Dielectric: X7R; Voltage: 100V; Value: 0.1u; Value on schem: 0.1u
C30 C33 = C_ECAP: as C5 on sheet p2_eth_rs232; Value: 220u; Value on schem: 220u
C36 C?#1 = C_ECAP: Aluminium capacitor; Part Number: UVR1J220MDD; Manufacturer: Nichicon; Tolerance: ± 20 %; Voltage: 63V; Value: 22u; Value on schem: 22u
C37 C38 C41 C42 C?#2 C?#3 = C_ECAP: Aluminium capacitor; Manufacturer: Nichicon; Tolerance: ± 20 %; Voltage: 63V; Value: 100u; Value on schem: 100u
DA4 DA5 = HCPL2630M: as DA1 on sheet p2_eth_rs232; Package: DIP-8; Part Number: HCPL2630M
DA6 = LM78L05ACZ: as DA3 on sheet p2_eth_rs232; Part Number: LM78L05ACZ; Package: TO-92
DA7 = NE5532P: DUAL LOW-NOISE OPERATIONAL AMPLIFIERS; Manufacturer: Texas Instruments; Part Number: NE5532P; Package: DIP-8
DA? = FOD817A: 5kV Phototransistor Optocoupler; Manufacturer: ON Semiconductor; Package: DIP-4; Part Number: FOD817A
K1 = SLA-12VDC-SL-C: Subminature high power relay 4P 30A; Manufacturer: Songle Relay; Coil Power Dissipation: 0.9W; Coil Current: 12V@75mA; Coil Resistance: 160 Ohm; Package: 32mm x27.5mm; Part Number: SLA-12VDC-SL-C
L3-L6 = EC24: as L1 on sheet p2_eth_rs232; Part Number: EC24-180K; Package: EC24
R20 R22 R29 R33 R40 R41 R?#4 R?#7 = CF25: as R1 on sheet p1_control_block; Value: 10k; Value on schem: 10k
R21 R24 R28 R30-R32 R?#1 = CF25: Resistor 1/4W; Part Number: MFR-25FTF52-330R; Manufacturer: Yageo; Tolerance: ± 1 %; Voltage: 250V; Temperature Coefficient: ±100 ppm/°C; Value: 330; Value on schem: 330
R23 R27 = CF25: Resistor 1/4W; Part Number: MFR-25FTF52-5R6; Manufacturer: Yageo; Tolerance: ± 1 %; Voltage: 250V; Temperature Coefficient: ±100 ppm/°C; Value: 5.6; Value on schem: 5.6
R25 R?#2 = SHUNT_15MM: Constantan shunt resistor, pitch = 15mm; Tolerance: ±  %; Temperature Coefficient: ±*/°C; Value: 0.05; Value on schem: 0.05; Part Number: *; Manufacturer: *; Voltage: *
R26 R35 R37 R42 R?#8 = CF25: as R3 on sheet p2_eth_rs232; Value: 1k; Value on schem: 1k
R34 R36 R38 = CF25: Resistor 1/4W; Part Number: MFR-25FTF52-3K3; Manufacturer: Yageo; Tolerance: ± 1 %; Voltage: 250V; Temperature Coefficient: ±100 ppm/°C; Value: 3.3k; Value on schem: 3.3k
R39 = CF25: Resistor 1/4W; Part Number: MFR-25FTF52-2K; Manufacturer: Yageo; Tolerance: ± 1 %; Voltage: 250V; Temperature Coefficient: ±100 ppm/°C; Value: 2k; Value on schem: 2k
R43 R?#9 = CF25: Resistor 1/4W; Part Number: MFR-25FTF52-47K; Manufacturer: Yageo; Tolerance: ± 1 %; Voltage: 250V; Temperature Coefficient: ±100 ppm/°C; Value: 47k; Value on schem: 47k
R44 R?#6 = CF25: Resistor 1/4W; Part Number: MFR-25FTF52-300K; Manufacturer: Yageo; Tolerance: ± 1 %; Voltage: 250V; Temperature Coefficient: ±100 ppm/°C; Value: 300k; Value on schem: 300k
R45 R?#5 = CF25: Resistor 1/4W; Part Number: MFR-25FTF52-4K3; Manufacturer: Yageo; Tolerance: ± 1 %; Voltage: 250V; Temperature Coefficient: ±100 ppm/°C; Value: 4.3k; Value on schem: 4.3k
R46 R?#10 = CF25: Resistor 1/4W; Part Number: MFR-25FTF52-470R; Manufacturer: Yageo; Tolerance: ± 1 %; Voltage: 250V; Temperature Coefficient: ±100 ppm/°C; Value: 470; Value on schem: 470
R47 R?#3 = CF25: Resistor 1/4W; Part Number: MFR-25FTF52-220R; Manufacturer: Yageo; Tolerance: ± 1 %; Voltage: 250V; Temperature Coefficient: ±100 ppm/°C; Value: 220; Value on schem: 220
R48 R?#11 = CF25: Resistor 1/4W; Part Number: MFR-25FTF52-15R; Manufacturer: Yageo; Tolerance: ± 1 %; Voltage: 250V; Temperature Coefficient: ±100 ppm/°C; Value: 15; Value on schem: 15
VD1 VD2 = BAT42: Small signal schottky diode 30V @ 200mA; Manufacturer: STMicroelectronics; Package: DO-35; Part Number: BAT42
VD3 = 1N4007RL: 1A 1000V Standard Recovery Rectifiers Diode; Manufacturer: ON Semiconductor; Part Number: 1N4007RL; Package: DO-41
VT1-VT5 VT7 = 2SA733: General Purpose p-n-p Transistors; Manufacturer: NEC; Package: TO-92; Part Number: 2SA733
VT6 VT9 VT?#2 = 2SC945: General Purpose n-p-n Transistors; Manufacturer: NEC; Package: TO-92; Part Number: 2SC945
VT8 VT?#1 = BD139: General Purpose n-p-n Transistors; Manufacturer: STMicroelectronics; Package: TO-126; Part Number: BD139
XS1 XS2 = DG500-5.08-02P-14: 2-way screw terminal, pitch 200mils (5.08mm); Manufacturer: DEGSON; Part Number: DG500-5.08-02P-14
XS3 = DG340-3.81-03P-12: 3-way screw terminal, pitch 150mils (3.81mm); Manufacturer: DEGSON; Part Number: DG340-3.81-03P-12
XS? = DG340-3.81-02P-12: 2-way screw terminal, pitch 150mils (3.81mm); Manufacturer: DEGSON; Part Number: DG340-3.81-02P-12

## Nets that join several sheets
GND: p1_control_block (16 pins), p2_eth_rs232 (C3.1 DA2.5), p3_keypad_encoder_led (23 pins), p4_power_measure_ch1 (5 pins)
VCC_3V3P: p2_eth_rs232 (6 pins), p3_keypad_encoder_led (11 pins), p4_power_measure_ch1 (7 pins)